# Altium project Konfident.PrjPcb
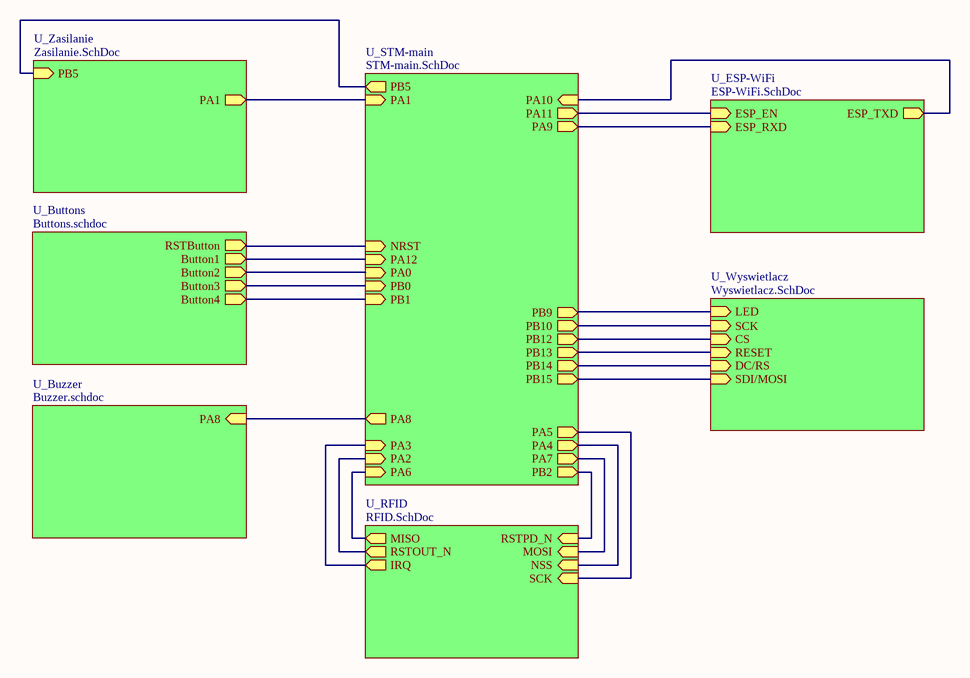
[diagram p0: Schemat_blokowy.SchDoc]
projGroupName: Niedzielni; projLocalName: Konfident; projSheetTotal: 8
8 sheets, 137 parts. Net scope: hierarchical (ports join the sheet entries above them; power ports are global).
Board file: PCB3.PcbDoc
Sheets:
  Schemat_blokowy.SchDoc
    U_Buttons = Buttons.schdoc
    U_Buzzer = Buzzer.schdoc
    U_ESP-WiFi = ESP-WiFi.SchDoc
    U_RFID = RFID.SchDoc
    U_Wyswietlacz = Wyswietlacz.SchDoc
    U_STM-main = STM-main.SchDoc
    U_Zasilanie = Zasilanie.SchDoc

## Sheet Schemat_blokowy.SchDoc
size 292 x 193 mm; Opracowal: Martyna Stankiewicz; projRevision: KD; Author: Martyna Stankiewicz; CompanyName: Politechnika Warszawska; Organization: EITI; Address1: Nowowiejska 15/19; Address2: 00-665 Warszawa; Revision: KD; SheetNumber: 1; SheetTotal: 8; HTTPLink: www.pw.edu.pl; Group_Name: Niedzielni; ProjName: Konfident

### Sub-sheets
U_Buttons = Buttons.schdoc: RSTButton (out), Button1 (out), Button2 (out), Button3 (out), Button4 (out)
U_Buzzer = Buzzer.schdoc: PA8 (in)
U_ESP-WiFi = ESP-WiFi.SchDoc: ESP_EN (in), ESP_TXD (out), ESP_RXD (in)
U_RFID = RFID.SchDoc: RSTPD_N (in), SCK (in), MISO (out), MOSI (in), NSS (in), RSTOUT_N (out), IRQ (out)
U_STM-main = STM-main.SchDoc: PA8 (out), PA9 (out), PA10 (in), PA11 (out), PA12 (in), PB9 (out), PB10 (out), PB12 (out), PB13 (out), PB14 (out), PB15 (out), NRST (in), PA0 (in), PA1 (in), PA2 (in), PA3 (in), PA5 (out), PA4 (out), PA6 (in), PA7 (out), PB0 (in), PB1 (in), PB2 (out), PB5 (out)
U_Wyswietlacz = Wyswietlacz.SchDoc: CS (in), RESET (in), DC/RS (in), SDI/MOSI (in), SCK (in), LED (in)
U_Zasilanie = Zasilanie.SchDoc: PA1 (out), PB5 (in)

### Nets
EN: sheet U_ESP-WiFi/ESP_EN, sheet U_STM-main/PA11
NRST: sheet U_Buttons/RSTButton, sheet U_STM-main/NRST
NetD2_1: sheet U_ESP-WiFi/ESP_RXD, sheet U_STM-main/PA9
NetJ2_3: sheet U_ESP-WiFi/ESP_TXD, sheet U_STM-main/PA10
NetJ4_3: sheet U_Wyswietlacz/CS, sheet U_STM-main/PB12
NetJ4_4: sheet U_Wyswietlacz/RESET, sheet U_STM-main/PB13
NetJ4_5: sheet U_Wyswietlacz/DC/RS, sheet U_STM-main/PB14
NetJ4_6: sheet U_Wyswietlacz/SDI/MOSI, sheet U_STM-main/PB15
NetJ4_7: sheet U_Wyswietlacz/SCK, sheet U_STM-main/PB10
NetJ4_8: sheet U_Wyswietlacz/LED, sheet U_STM-main/PB9
NetR6_1: sheet U_STM-main/PA1, sheet U_Zasilanie/PA1
NetR7_1: sheet U_STM-main/PB5, sheet U_Zasilanie/PB5
NetR21_1: sheet U_RFID/RSTPD_N, sheet U_STM-main/PB2
NetR23_2: sheet U_RFID/MISO, sheet U_STM-main/PA6
NetR24_2: sheet U_RFID/MOSI, sheet U_STM-main/PA7
NetR34_1: sheet U_Buzzer/PA8, sheet U_STM-main/PA8
NetS2_1: sheet U_Buttons/Button1, sheet U_STM-main/PA12
NetS3_1: sheet U_Buttons/Button2, sheet U_STM-main/PA0
NetS4_1: sheet U_Buttons/Button3, sheet U_STM-main/PB0
NetS5_1: sheet U_Buttons/Button4, sheet U_STM-main/PB1
NetU1_12: sheet U_RFID/RSTOUT_N, sheet U_STM-main/PA2
NetU1_13: sheet U_RFID/IRQ, sheet U_STM-main/PA3
NetU1_14: sheet U_RFID/NSS, sheet U_STM-main/PA4
NetU1_15: sheet U_RFID/SCK, sheet U_STM-main/PA5

### Notes on the sheet
- Data:
- Tytuł:
- Rev.:
- Rozm.:
- A4
- Strona:
- z
- PBL4
- Opracował:

## Sheet Buttons.schdoc
size 292 x 193 mm; Opracowal: Martyna Stankiewicz; projRevision: KD; Author: Martyna Stankiewicz; CompanyName: Politechnika Warszawska; Organization: EITI; Address1: Nowowiejska 15/19; Address2: 00-665 Warszawa; Revision: KD; SheetNumber: 6; SheetTotal: 8; HTTPLink: www.pw.edu.pl; Group_Name: Niedzielni; ProjName: Konfident
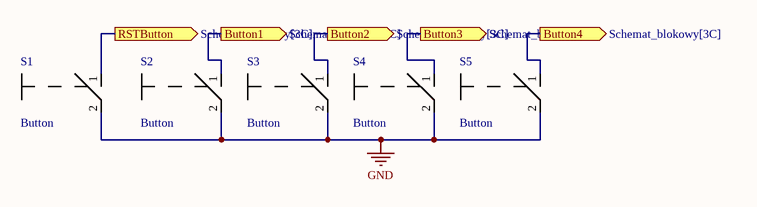
[diagram p1: Buttons.schdoc]

### Parts
S1  Button  [SW_TL59NF160Q]
S2  Button  [SW_TL59NF160Q]
S3  Button  [SW_TL59NF160Q]
S4  Button  [SW_TL59NF160Q]
S5  Button  [SW_TL59NF160Q]

### Ports
Button1 (out, see Schemat_blokowy[3C]), Button2 (out, see Schemat_blokowy[3C]), Button3 (out, see Schemat_blokowy[3C]), Button4 (out, see Schemat_blokowy[3C]), RSTButton (out, see Schemat_blokowy[3C])

### Nets
GND: S1.2 S2.2 S3.2 S4.2 S5.2
NRST: S1.1 ; port RSTButton
NetS2_1: S2.1 ; port Button1
NetS3_1: S3.1 ; port Button2
NetS4_1: S4.1 ; port Button3
NetS5_1: S5.1 ; port Button4

### Notes on the sheet
- Data:
- Tytuł:
- Rev.:
- Rozm.:
- A4
- Strona:
- z
- PBL4
- Opracował:

### Library data of the parts
S1-S5 = Button: PartNumber: TL59NF160Q

## Sheet Buzzer.schdoc
size 292 x 193 mm; Opracowal: Martyna Stankiewicz; projRevision: MM; Author: Martyna Stankiewicz; CompanyName: Politechnika Warszawska; Organization: EITI; Address1: Nowowiejska 15/19; Address2: 00-665 Warszawa; Revision: MM; SheetNumber: 7; SheetTotal: 8; HTTPLink: www.pw.edu.pl; Group_Name: Niedzielni; ProjName: Konfident
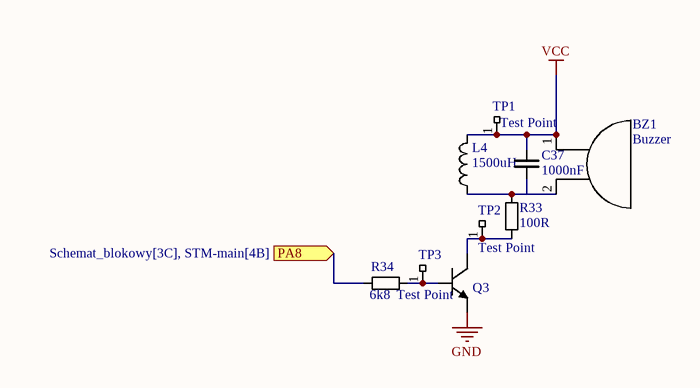
[diagram p2: Buzzer.schdoc]

### Parts
BZ1  Buzzer  [XDCR_PS1240P02BT]
C37  1000nF  [0603_CAP]
L4  1500uH  [IND_LQH43MN152K03L]
Q3  NPN  [SOT95P240X110-3N]  (value not drawn)
R33  100R  [0603_RES]
R34  6k8  [0603_RES]
TP1  Test Point  [pad]  (no BOM)
TP2  Test Point  [pad]  (no BOM)
TP3  Test Point  [pad]  (no BOM)

### Ports
PA8 (in, see Schemat_blokowy[3C], STM-main[4B])

### Nets
GND: Q3.2(E)
VCC: BZ1.1 C37.2 L4.2 TP1.1
NetBZ1_2: BZ1.2 C37.1 L4.1 R33.2
NetQ3_1: Q3.1(B) R34.2 TP3.1
NetQ3_3: Q3.3(C) R33.1 TP2.1
NetR34_1: R34.1 ; port PA8

### Notes on the sheet
- Data:
- Tytuł:
- Rev.:
- Rozm.:
- A4
- Strona:
- z
- PBL4
- Opracował:

### Library data of the parts
BZ1 = Buzzer: PartNumber: PS1240P02BT
C37 = Cap: Ceramic capacitor; Value: 1000nF
L4 = Inductor: PartNumber: LQH43MN152J03L; Value: 1500uH; Link: https://www.digikey.pl/en/products/detail/murata-electronics/LQH43MN152J03L/2594506?_gl=1*1qj429k*_up*MQ..*_gs*MQ..&gclid=Cj0KCQjwqcO_BhDaARIsACz62vPoBc739cp1REhPwRacIq9Hmi_6DHVVJt4UIt_29A6Hw2SO46MFMW8aApgZEALw_wcB&gclsrc=aw.ds
Q3 = NPN: NPN General-purpose Transistor; PartNumber: BC848C-7-F; Link: https://www.digikey.pl/en/products/detail/diodes-incorporated/BC848C-7-F/1934460?s=N4IgTCBcDaIEIGEAcAWJCC0B2DAxEAugL5A
R33 R34 = RES: Resistor
  R33: Value: 100R
  R34: Value: 6k8

## Sheet ESP-WiFi.SchDoc
size 292 x 193 mm; Opracowal: Krzysztof Dobosz; projRevision: MS; CompanyName: Politechnika Warszawska; Organization: EITI; Address1: Nowowiejska 15/19; Address2: 00-665 Warszawa; Revision: MS; SheetNumber: 3; SheetTotal: 8; HTTPLink: www.pw.edu.pl; Group_Name: Niedzielni; ProjName: Konfident
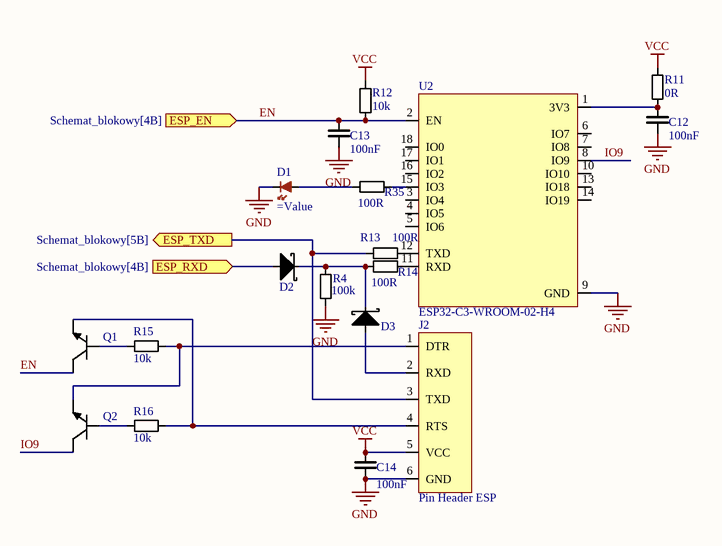
[diagram p3: ESP-WiFi.SchDoc]

### Parts
C12  100nF  [0603_CAP]
C13  100nF  [0603_CAP]
C14  100nF  [0603_CAP]
D1  (no value)  [0603_LED_R_Reflow]
D2  (no value)  [SOT23-R]
D3  (no value)  [SOT23-R]
J2  Pin Header ESP  [SAMTEC_TSW-112-16-T-S-06]
Q1  NPN  [SOT95P240X110-3N]  (value not drawn)
Q2  NPN  [SOT95P240X110-3N]  (value not drawn)
R4  100k  [0603_RES]
R11  0R  [0603_RES]
R12  10k  [0603_RES]
R13  100R  [0603_RES]
R14  100R  [0603_RES]
R15  10k  [0603_RES]
R16  10k  [0603_RES]
R35  100R  [0603_RES]
U2  ESP32-C3-WROOM-02-H4  [MODULE_ESP32-C3-WROOM-02-H4]

### Ports
ESP_EN (in, see Schemat_blokowy[4B]), ESP_RXD (in, see Schemat_blokowy[4B]), ESP_TXD (out, see Schemat_blokowy[5B])

### Nets
GND: C12.1 C13.1 C14.1 D1.2(K) J2.6(GND) R4.1 U2.9(GND)
VCC: C14.2 J2.5(VCC) R11.2 R12.2
EN: C13.2 Q1.3(C) R12.1 U2.2(EN) ; port ESP_EN
IO9: Q2.3(C) U2.8(IO9)
NetC12_2: C12.2 R11.1 U2.1(3V3)
NetD1_1: D1.1(A) R35.1
NetD2_1: D2.1(A) ; port ESP_RXD
NetD2_3: D2.3(K) D3.3(K) R4.2 R14.1
NetD3_1: D3.1(A) J2.2(RXD)
NetJ2_1: J2.1(DTR) Q2.2(E) R15.1
NetJ2_3: J2.3(TXD) R13.1 ; port ESP_TXD
NetJ2_4: J2.4(RTS) Q1.2(E) R16.1
NetQ1_1: Q1.1(B) R15.2
NetQ2_1: Q2.1(B) R16.2
NetR13_2: R13.2 U2.12(TXD)
NetR14_2: R14.2 U2.11(RXD)
NetR35_2: R35.2 U2.15(IO3)

Not connected (* = marked no-connect by the designer): U2 3(IO4) 4(IO5) 5(IO6) 6(IO7) 7(IO8) 10(IO10) 13(IO18) 14(IO19) 16(IO2) 17(IO1) 18(IO0)

### Notes on the sheet
- Data:
- Tytuł:
- Rev.:
- Rozm.:
- A4
- Strona:
- z
- PBL4
- Opracował:

### Library data of the parts
C12-C14 = Cap: Ceramic capacitor; Value: 100nF
D1 = LED_R_small: Red LED diode; PartNumber: APT1608SURC; Link: https://www.mouser.pl/ProductDetail/Kingbright/APT1608SURC?qs=SxaZfIVsCL1abw2IbECoZw%3D%3D
D2 D3 = D Schottky: Schottky Diode; PartNumber: BAT54C; Link: https://www.digikey.pl/en/products/detail/diotec-semiconductor/BAT54C/13163831
Q1 Q2 = NPN: as Q3 on sheet Buzzer; Link: https://www.digikey.pl/en/products/detail/diodes-incorporated/BC848C-7-F/1934460?s=N4IgTCBcDaIEIGEAcAWJCC0B2DAxEAugL5A
R4 R11-R16 R35 = RES: Resistor
  R4: Value: 100k
  R11: Value: 0R
  R12 R15 R16: Value: 10k
  R13 R14 R35: Value: 100R
U2 = ESP32-C3-WROOM-02-H4: WiFi Modules (802.11) (Engineering Samples) SMD module, ESP32-C3, 4MB SPI flash, PCB antenna, -40 C +105 C; MF: Espressif Systems; MP: ESP32-C3-WROOM-02-H4; Package: Package; Purchase-URL: https://pricing.snapeda.com/search/part/ESP32-C3-WROOM-02-H4/?ref=eda; Check_prices: https://www.snapeda.com/parts/ESP32-C3-WROOM-02-H4/Espressif+Systems/view-part/?ref=eda; SnapEDA_Link: https://www.snapeda.com/parts/ESP32-C3-WROOM-02-H4/Espressif+Systems/view-part/?ref=snap; Price: None; Availability: In Stock; Value: *; PartNumber: ESP32-C3-WROOM-02-H4

## Sheet RFID.SchDoc
size 292 x 193 mm; Opracowal: Krzysztof Dobosz; projRevision: MM; Author: Krzysztof Dobosz; CompanyName: Politechnika Warszawska; Organization: EITI; Address1: Nowowiejska 15/19; Address2: 00-665 Warszawa; Revision: MM; SheetNumber: 4; SheetTotal: 8; HTTPLink: www.pw.edu.pl; Group_Name: Niedzielni; ProjName: Konfident
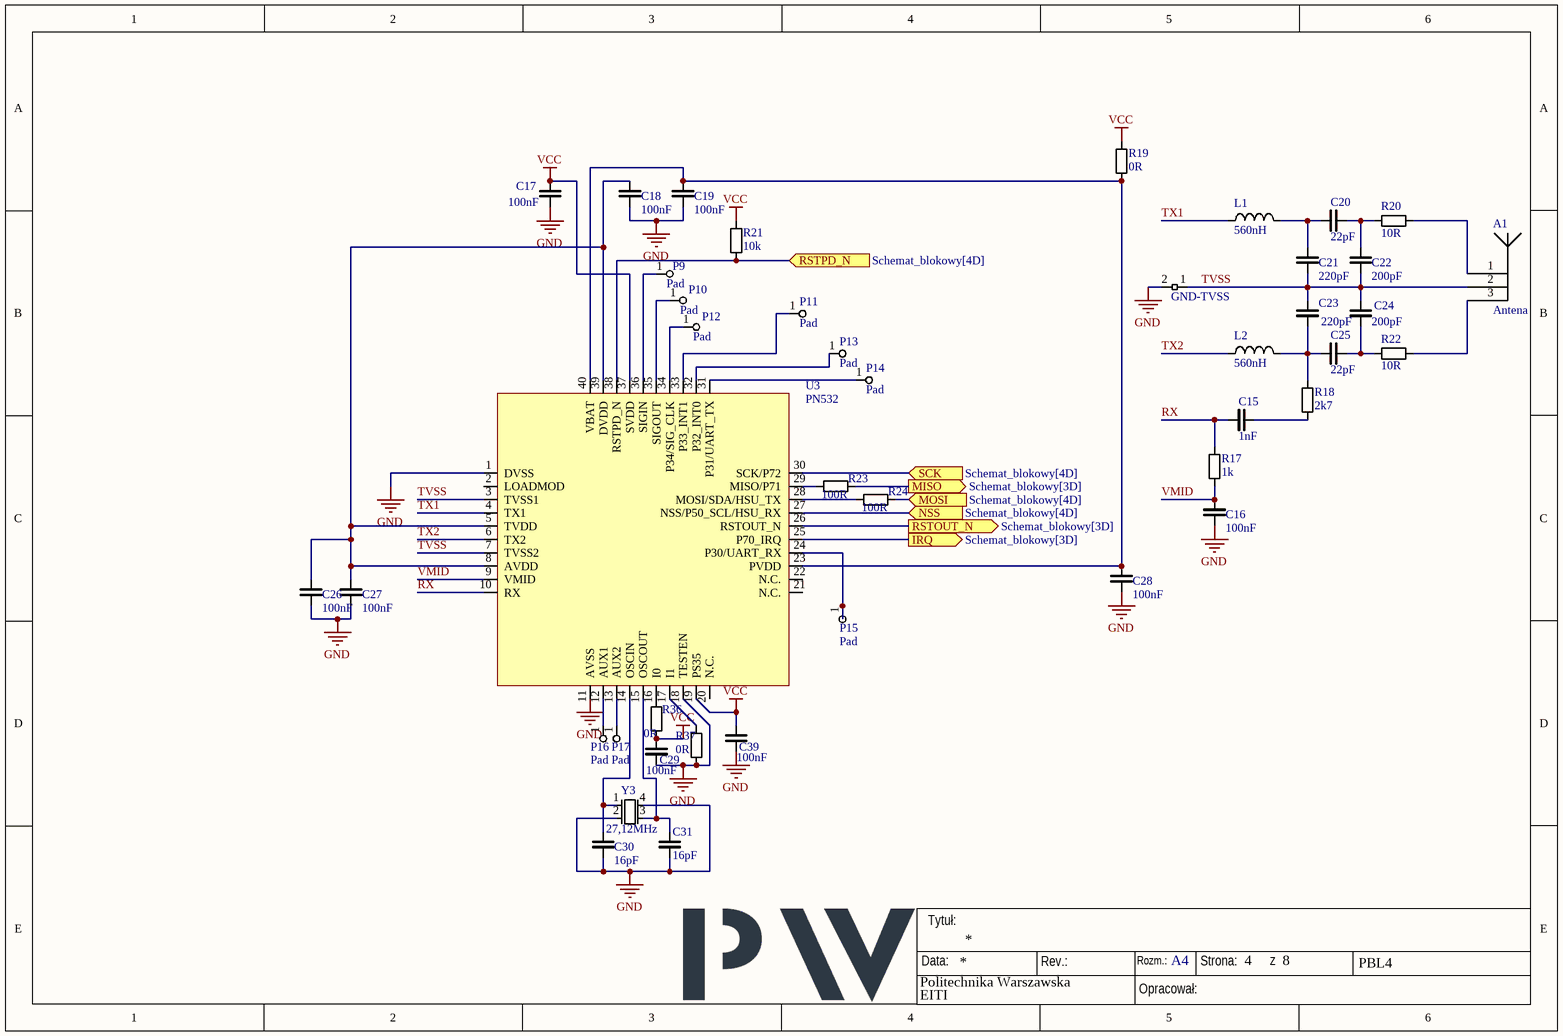
[diagram p4: RFID.SchDoc]

### Parts
A1  Antena  [Antena_RFID]  (net tie, no BOM)
C15  1nF  [0603_CAP]
C16  100nF  [0603_CAP]
C17  100nF  [0603_CAP]
C18  100nF  [0603_CAP]
C19  100nF  [0603_CAP]
C20  22pF  [0603_CAP]
C21  220pF  [0603_CAP]
C22  200pF  [0603_CAP]
C23  220pF  [0603_CAP]
C24  200pF  [0603_CAP]
C25  22pF  [0603_CAP]
C26  100nF  [0603_CAP]
C27  100nF  [0603_CAP]
C28  100nF  [0603_CAP]
C29  100nF  [0603_CAP]
C30  16pF  [0603_CAP]
C31  16pF  [0603_CAP]
C39  100nF  [0603_CAP]
L1  560nH  [0603_IND]
L2  560nH  [0603_IND]
P9  Pad  [pad]  (no BOM)
P10  Pad  [pad]  (no BOM)
P11  Pad  [pad]  (no BOM)
P12  Pad  [pad]  (no BOM)
P13  Pad  [pad]  (no BOM)
P14  Pad  [pad]  (no BOM)
P15  Pad  [pad]  (no BOM)
P16  Pad  [pad]  (no BOM)
P17  Pad  [pad]  (no BOM)
R17  1k  [0603_RES]
R18  2k7  [0603_RES]
R19  0R  [0603_RES]
R20  10R  [0603_RES]
R21  10k  [0603_RES]
R22  10R  [0603_RES]
R23  100R  [0603_RES]
R24  100R  [0603_RES]
R36  0R  [0603_RES]
R37  0R  [0603_RES]
U3  PN532  [QFN40G-0.5-6X6MM]
Y3  27,12MHz  [XTAL_ABM8-27.120MHZ-10-D1G-T]
  GND-TVSS  [GND-TVSS]  (net tie, no BOM)

### Ports
IRQ (out, see Schemat_blokowy[3D]), MISO (out, see Schemat_blokowy[3D]), MOSI (in, see Schemat_blokowy[4D]), NSS (in, see Schemat_blokowy[4D]), RSTOUT_N (out, see Schemat_blokowy[3D]), RSTPD_N (in, see Schemat_blokowy[4D]), SCK (in, see Schemat_blokowy[4D])

### Nets
GND: C16.1 C17.1 C18.1 C19.1 C26.1 C27.1 C28.1 C29.1 C30.1 C31.1 C39.1 R37.1 U3.1(DVSS) U3.11(AVSS) U3.18(TESTEN) Y3.2 Y3.4 .2
VCC: C17.2 C29.2 C39.2 R19.2 R21.2 R36.1 U3.19(PS35) U3.37(SVDD)
RX: C15.1 R17.2 U3.10(RX)
TVSS: A1.2 C21.1 C22.1 C23.2 C24.2 U3.3(TVSS1) U3.7(TVSS2) .1
TX1: L1.1 U3.4(TX1)
TX2: L2.1 U3.6(TX2)
VMID: C16.2 R17.1 U3.9(VMID)
NetA1_1: A1.1 R20.1
NetA1_3: A1.3 R22.1
NetC15_2: C15.2 R18.1
NetC18_2: C18.2 C26.2 C27.2 U3.5(TVDD) U3.8(AVDD) U3.39(DVDD)
NetC19_2: C19.2 C28.2 R19.1 U3.23(PVDD) U3.40(VBAT)
NetC20_1: C20.1 C22.2 R20.2
NetC20_2: C20.2 C21.2 L1.2
NetC23_1: C23.1 C25.2 L2.2 R18.2
NetC24_1: C24.1 C25.1 R22.2
NetC30_2: C30.2 U3.14(OSCIN) Y3.1
NetC31_2: C31.2 U3.15(OSCOUT) Y3.3
NetP9_1: P9.1 U3.36(SIGIN)
NetP10_1: P10.1 U3.35(SIGOUT)
NetP11_1: P11.1 U3.33(P33_INT1)
NetP12_1: P12.1 U3.34(P34/SIG_CLK)
NetP13_1: P13.1 U3.32(P32_INT0)
NetP14_1: P14.1 U3.31(P31/UART_TX)
NetP15_1: P15.1 U3.24(P30/UART_RX)
NetP16_1: P16.1 U3.12(AUX1)
NetP17_1: P17.1 U3.13(AUX2)
NetR21_1: R21.1 U3.38(RSTPD_N) ; port RSTPD_N
NetR23_1: R23.1 U3.29(MISO/P71)
NetR23_2: R23.2 ; port MISO
NetR24_1: R24.1 U3.28(MOSI/SDA/HSU_TX)
NetR24_2: R24.2 ; port MOSI
NetR36_2: R36.2 U3.16(I0)
NetR37_2: R37.2 U3.17(I1)
NetU1_12: U3.26(RSTOUT_N) ; port RSTOUT_N
NetU1_13: U3.25(P70_IRQ) ; port IRQ
NetU1_14: U3.27(NSS/P50_SCL/HSU_RX) ; port NSS
NetU1_15: U3.30(SCK/P72) ; port SCK

Not connected (* = marked no-connect by the designer): U3 2(LOADMOD) 20(N.C.) 21(N.C.) 22(N.C.)

### Notes on the sheet
- Data:
- Tytuł:
- Rev.:
- Rozm.:
- A4
- Strona:
- z
- PBL4
- Opracował:

### Library data of the parts
C15-C31 C39 = Cap: Ceramic capacitor
  C15: Value: 1nF
  C16-C19 C26-C29 C39: Value: 100nF
  C20 C25: Value: 22pF
  C21 C23: Value: 220pF
  C22 C24: Value: 200pF
  C30 C31: Value: 16pF
L1 L2 = Inductor: PartNumber: CS160808-R56K; Value: 560nH; Link: https://www.digikey.pl/en/products/detail/bourns-inc/CS160808-R56K/3782656?_gl=1*10p3aaq*_up*MQ..*_gs*MQ..&gclid=Cj0KCQjwqcO_BhDaARIsACz62vPoBc739cp1REhPwRacIq9Hmi_6DHVVJt4UIt_29A6Hw2SO46MFMW8aApgZEALw_wcB&gclsrc=aw.ds
R17-R24 R36 R37 = RES: Resistor
  R17: Value: 1k
  R18: Value: 2k7
  R19 R36 R37: Value: 0R
  R20 R22: Value: 10R
  R21: Value: 10k
  R23 R24: Value: 100R
U3 = PN532: RFID module; PartNumber: PN5321A3HN/C106,55; Link: https://www.digikey.pl/en/products/detail/nxp-usa-inc/PN5321A3HN-C106-55/2296487
Y3 = Oscylator4: Oscilator; PartNumber: ABM8-27.120MHZ-10-D1G-T; Value: 27,12MHz; Link: https://www.digikey.pl/en/products/detail/abracon-llc/ABM8-27-120MHZ-10-D1G-T/8582027?_gl=1%2A1j4zvvg%2A_up%2AMQ..%2A_gs%2AMQ..&gclid=Cj0KCQjwtJ6_BhDWARIsAGanmKdDq7PmRTSwRQOEO6Y2chDsJ8ztLHAI7vvkfzRwrFQTKCYtsUalh8YaArHxEALw_wcB&gclsrc=aw.ds&fbclid=IwZXh0bgNhZW0CMTEAAR7Ivqi7CRUEsP8rOnd4--mHHE_K_pobXq-Us6J-BY0xbOx55-b20eDGrpVyWg_aem_WjV6ZaoX7HlUqguWX5el7Q

## Sheet Wyswietlacz.SchDoc
size 292 x 193 mm; Opracowal: Mieszko Mazurkiewicz; projRevision: MS; Author: Mieszko Mazurkiewicz; CompanyName: Politechnika Warszawska; Organization: EITI; Address1: Nowowiejska 15/19; Address2: 00-665 Warszawa; Revision: MS; SheetNumber: 8; SheetTotal: 8; HTTPLink: www.pw.edu.pl; Group_Name: Niedzielni; ProjName: Konfident
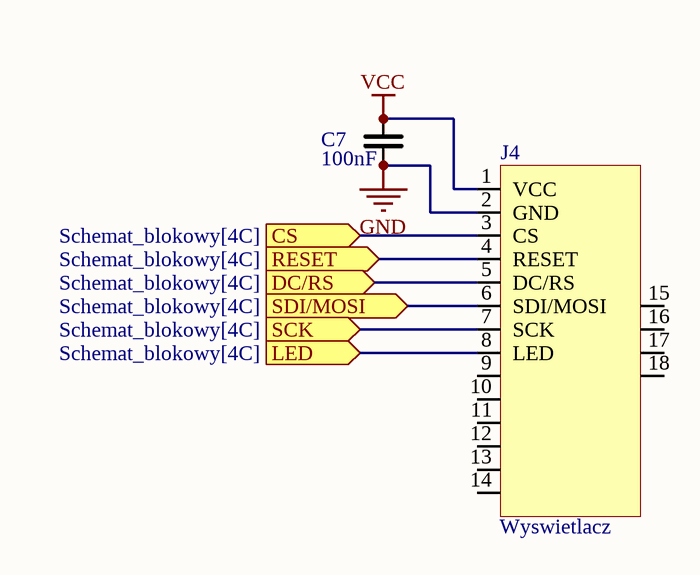
[diagram p5: Wyswietlacz.SchDoc]

### Parts
C7  100nF  [0603_CAP]
J4  Wyswietlacz  [pin_header_LCD]

### Ports
CS (in, see Schemat_blokowy[4C]), DC/RS (in, see Schemat_blokowy[4C]), LED (in, see Schemat_blokowy[4C]), RESET (in, see Schemat_blokowy[4C]), SCK (in, see Schemat_blokowy[4C]), SDI/MOSI (in, see Schemat_blokowy[4C])

### Nets
GND: C7.1 J4.2(GND)
VCC: C7.2 J4.1(VCC)
NetJ4_3: J4.3(CS) ; port CS
NetJ4_4: J4.4(RESET) ; port RESET
NetJ4_5: J4.5(DC/RS) ; port DC/RS
NetJ4_6: J4.6(SDI/MOSI) ; port SDI/MOSI
NetJ4_7: J4.7(SCK) ; port SCK
NetJ4_8: J4.8(LED) ; port LED

Not connected (* = marked no-connect by the designer): J4 9 10 11 12 13 14 15 16 17 18

### Notes on the sheet
- Data:
- Tytuł:
- Rev.:
- Rozm.:
- A4
- Strona:
- z
- PBL4
- Opracował:

### Library data of the parts
C7 = Cap: Ceramic capacitor; Value: 100nF
J4 = Pin Header Wyswietlacz: Dispaly; PartNumber: ILI9486

## Sheet STM-main.SchDoc
size 292 x 193 mm; Opracowal: Mieszko Mazurkiewicz; projRevision: KD; Author: Mieszko Mazurkiewicz; CompanyName: Politechnika Warszawska; Organization: EITI; Address1: Nowowiejska 15/19; Address2: 00-665 Warszawa; Revision: KD; SheetNumber: 2; SheetTotal: 8; HTTPLink: www.pw.edu.pl; Group_Name: Niedzielni; ProjName: Konfident
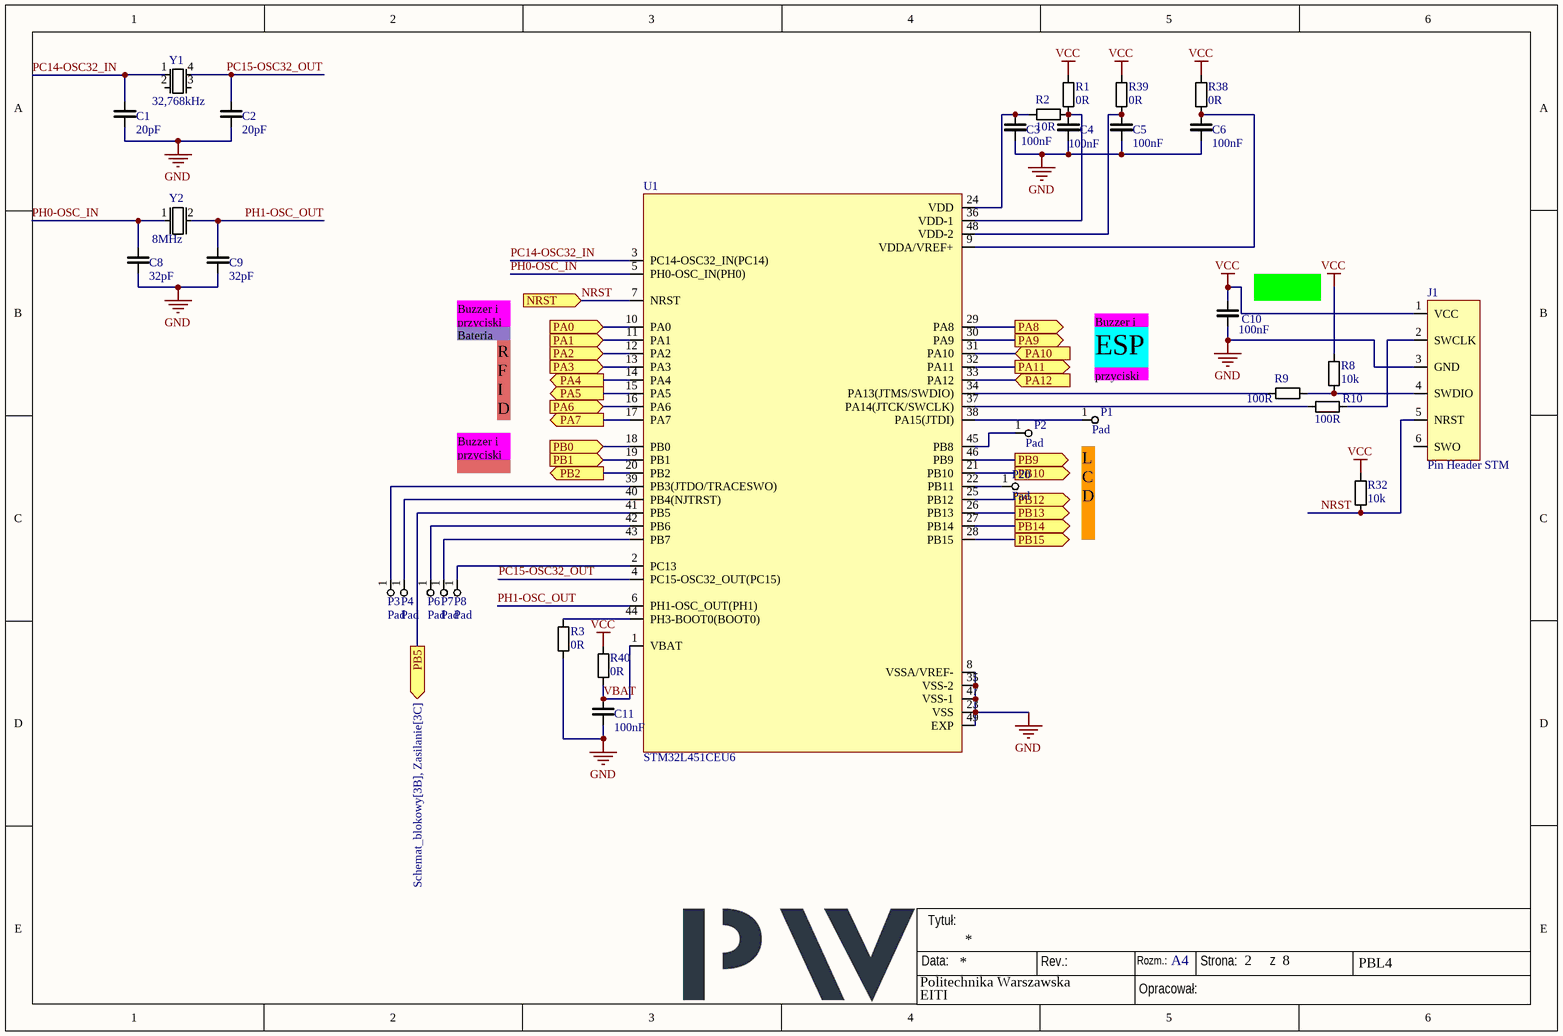
[diagram p6: STM-main.SchDoc]

### Parts
C1  20pF  [0603_CAP]
C2  20pF  [0603_CAP]
C3  100nF  [0603_CAP]
C4  100nF  [0603_CAP]
C5  100nF  [0603_CAP]
C6  100nF  [0603_CAP]
C8  32pF  [0603_CAP]
C9  32pF  [0603_CAP]
C10  100nF  [0603_CAP]
C11  100nF  [0603_CAP]
J1  Pin Header STM  [SAMTEC_TSW-112-16-T-S-06]
P1  Pad  [pad]  (no BOM)
P2  Pad  [pad]  (no BOM)
P3  Pad  [pad]  (no BOM)
P4  Pad  [pad]  (no BOM)
P6  Pad  [pad]  (no BOM)
P7  Pad  [pad]  (no BOM)
P8  Pad  [pad]  (no BOM)
P20  Pad  [pad]  (no BOM)
R1  0R  [0603_RES]
R2  10R  [0603_RES]
R3  0R  [0603_RES]
R8  10k  [0603_RES]
R9  100R  [0603_RES]
R10  100R  [0603_RES]
R32  10k  [0603_RES]
R38  0R  [0603_RES]
R39  0R  [0603_RES]
R40  0R  [0603_RES]
U1  STM32L451CEU6  [QFN50P700X700X60-49N]
Y1  32,768kHz  [Q 0,032768-SMQ32SL-12,5-20-T1-LF]
Y2  8MHz  [ATS080BSM-1E]

### Ports
NRST (in, see Schemat_blokowy[3C]), PA0 (in, see Schemat_blokowy[3C]), PA1 (in, see Schemat_blokowy[3B], Zasilanie[3B]), PA2 (in, see Schemat_blokowy[3D]), PA3 (in, see Schemat_blokowy[3D]), PA4 (out, see Schemat_blokowy[4D]), PA5 (out, see Schemat_blokowy[4D]), PA6 (in, see Schemat_blokowy[3D]), PA7 (out, see Schemat_blokowy[4D]), PA8 (out, see Schemat_blokowy[3C], Buzzer[2C]), PA9 (out, see Schemat_blokowy[4B]), PA10 (in, see Schemat_blokowy[4B]), PA11 (out, see Schemat_blokowy[4B]), PA12 (in, see Schemat_blokowy[3C]), PB0 (in, see Schemat_blokowy[3C]), PB1 (in, see Schemat_blokowy[3C]), PB2 (out, see Schemat_blokowy[4D]), PB5 (out, see Schemat_blokowy[3B], Zasilanie[3C]), PB9 (out, see Schemat_blokowy[4C]), PB10 (out, see Schemat_blokowy[4C]), PB12 (out, see Schemat_blokowy[4C]), PB13 (out, see Schemat_blokowy[4C]), PB14 (out, see Schemat_blokowy[4C]), PB15 (out, see Schemat_blokowy[4C])

### Nets
GND: C1.1 C2.1 C3.1 C4.1 C5.1 C6.1 C8.1 C9.1 C10.1 C11.1 J1.3(GND) R3.1 U1.8(VSSA/VREF-) U1.23(VSS) U1.35(VSS-2) U1.47(VSS-1) U1.49(EXP)
VCC: C10.2 J1.1(VCC) R1.2 R8.2 R32.2 R38.2 R39.2 R40.2
EN: U1.32(PA11) ; port PA11
NRST: J1.5(NRST) R32.1 U1.7(NRST) ; port NRST
PC14-OSC32_IN: C1.2 U1.3(PC14-OSC32_IN(PC14)) Y1.1
PC15-OSC32_OUT: C2.2 U1.4(PC15-OSC32_OUT(PC15)) Y1.4
PH0-OSC_IN: C8.2 U1.5(PH0-OSC_IN(PH0)) Y2.1
PH1-OSC_OUT: C9.2 U1.6(PH1-OSC_OUT(PH1)) Y2.2
VBAT: C11.2 R40.1 U1.1(VBAT)
NetC3_2: C3.2 R2.1 U1.24(VDD)
NetC4_2: C4.2 R1.1 R2.2 U1.36(VDD-1)
NetC5_2: C5.2 R39.1 U1.48(VDD-2)
NetC6_2: C6.2 R38.1 U1.9(VDDA/VREF+)
NetD2_1: U1.30(PA9) ; port PA9
NetJ1_2: J1.2(SWCLK) R10.2
NetJ1_4: J1.4(SWDIO) R8.1 R9.2
NetJ2_3: U1.31(PA10) ; port PA10
NetJ4_3: U1.25(PB12) ; port PB12
NetJ4_4: U1.26(PB13) ; port PB13
NetJ4_5: U1.27(PB14) ; port PB14
NetJ4_6: U1.28(PB15) ; port PB15
NetJ4_7: U1.21(PB10) ; port PB10
NetJ4_8: U1.46(PB9) ; port PB9
NetP1_1: P1.1 U1.38(PA15(JTDI))
NetP2_1: P2.1 U1.45(PB8)
NetP3_1: P3.1 U1.39(PB3(JTDO/TRACESWO))
NetP4_1: P4.1 U1.40(PB4(NJTRST))
NetP6_1: P6.1 U1.42(PB6)
NetP7_1: P7.1 U1.43(PB7)
NetP8_1: P8.1 U1.2(PC13)
NetP20_1: P20.1 U1.22(PB11)
NetR3_2: R3.2 U1.44(PH3-BOOT0(BOOT0))
NetR6_1: U1.11(PA1) ; port PA1
NetR7_1: U1.41(PB5) ; port PB5
NetR9_1: R9.1 U1.34(PA13(JTMS/SWDIO))
NetR10_1: R10.1 U1.37(PA14(JTCK/SWCLK))
NetR21_1: U1.20(PB2) ; port PB2
NetR23_2: U1.16(PA6) ; port PA6
NetR24_2: U1.17(PA7) ; port PA7
NetR34_1: U1.29(PA8) ; port PA8
NetS2_1: U1.33(PA12) ; port PA12
NetS3_1: U1.10(PA0) ; port PA0
NetS4_1: U1.18(PB0) ; port PB0
NetS5_1: U1.19(PB1) ; port PB1
NetU1_12: U1.12(PA2) ; port PA2
NetU1_13: U1.13(PA3) ; port PA3
NetU1_14: U1.14(PA4) ; port PA4
NetU1_15: U1.15(PA5) ; port PA5

Not connected (* = marked no-connect by the designer): J1 6(SWO); Y1 2 3

### Notes on the sheet
- (near C10) SWD
- Buzzer i
  przyciski
- Bateria
- (near P1) Buzzer i
  przyciski
- ESP
- R
  F
  I
  D
- RFID
- (near P1) L
  C
  D
- Data:
- Tytuł:
- Rev.:
- Rozm.:
- A4
- Strona:
- z
- PBL4
- Opracował:

### Library data of the parts
C1-C6 C8-C11 = Cap: Ceramic capacitor
  C1 C2: Value: 20pF
  C3-C6 C10 C11: Value: 100nF
  C8 C9: Value: 32pF
R1-R3 R8-R10 R32 R38-R40 = RES: Resistor
  R1 R3 R38-R40: Value: 0R
  R2: Value: 10R
  R8 R32: Value: 10k
  R9 R10: Value: 100R
Y1 = Oscylator4: Oscilator; Value: 32,768kHz; PartNumber: Q 0,032768-SMQ32SL-12,5-20-T1-LF; Link: https://www.digikey.pl/en/products/detail/jauch-quartz/Q-0-032768-SMQ32SL-12-5-20-T1-LF/21286751?_gl=1%2A2eagbn%2A_up%2AMQ..%2A_gs%2AMQ..&gclid=Cj0KCQjwtJ6_BhDWARIsAGanmKdDq7PmRTSwRQOEO6Y2chDsJ8ztLHAI7vvkfzRwrFQTKCYtsUalh8YaArHxEALw_wcB&gclsrc=aw.ds&fbclid=IwZXh0bgNhZW0CMTEAAR5vhhD_Q673JviUlLJ614BYKrSfCtvcQBHdiJxk0akfVJH2lUWrq4RgPhm8Mw_aem_d1V_8h-L4hTcNT0FPwb2dg
Y2 = Oscylator: Oscilator; Value: 8MHz; PartNumber: ATS080BSM-1E; Link: https://www.digikey.pl/en/products/detail/cts-frequency-controls/ATS080BSM-1E/4308686?_gl=1%2Acv1dpn%2A_up%2AMQ..%2A_gs%2AMQ..&gclid=Cj0KCQjwtJ6_BhDWARIsAGanmKdDq7PmRTSwRQOEO6Y2chDsJ8ztLHAI7vvkfzRwrFQTKCYtsUalh8YaArHxEALw_wcB&gclsrc=aw.ds&fbclid=IwZXh0bgNhZW0CMTEAAR769WtCyuMDpBpLjQbkyGDyyz4UOol-R9__mkEURnvs7i-NTlbvwc0iaZLtNw_aem_AJwTIGPzL7xMi4E202jF3w
U1 = STM32L451CEU6: PartNumber: STM32L451CEU6

## Sheet Zasilanie.SchDoc
size 292 x 193 mm; SPICEModelCacheTYRFPEPP: <root> / <DocumentId>TYRFPEPP</DocumentId> / </root>; Opracowal: Krzysztof Dobosz; projRevision: MM; Author: Krzysztof Dobosz; CompanyName: Politechnika Warszawska; Organization: EITI; Address1: Nowowiejska 15/19; Address2: 00-665 Warszawa; Revision: MM; SheetNumber: 5; SheetTotal: 8; HTTPLink: www.pw.edu.pl; Group_Name: Niedzielni; ProjName: Konfident
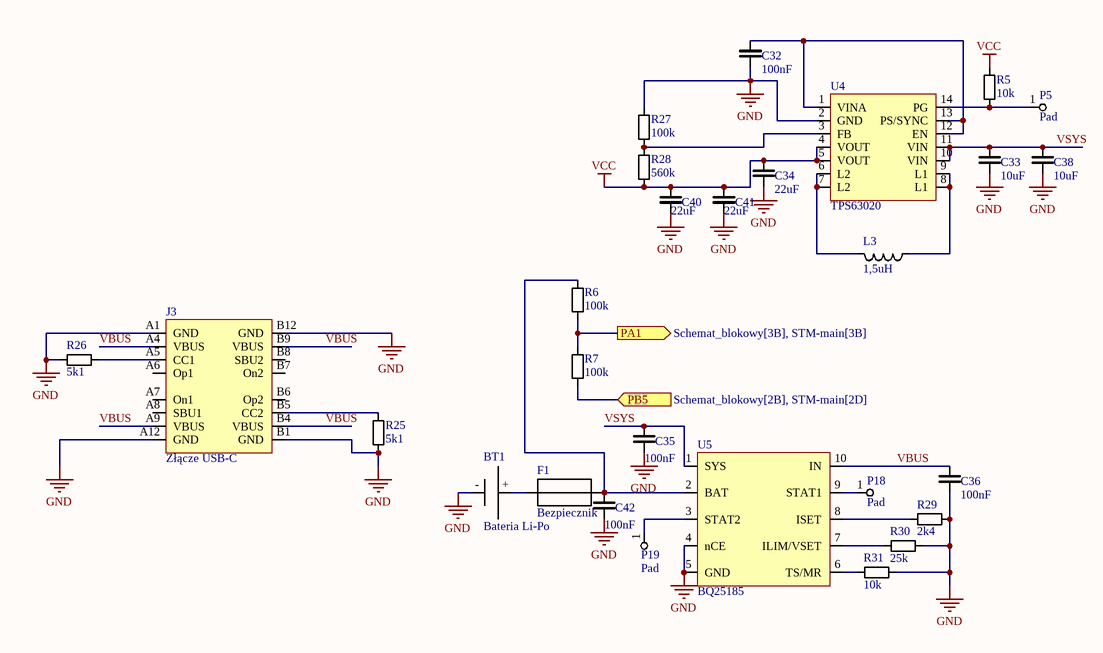
[diagram p7: Zasilanie.SchDoc]

### Parts
BT1  Bateria Li-Po  [LP623255 3,7V 1100mAh]  (net tie)
C32  100nF  [0603_CAP]
C33  10uF  [0603_CAP]
C34  22uF  [0603_CAP]
C35  100nF  [0603_CAP]
C36  100nF  [0603_CAP]
C38  10uF  [0603_CAP]
C40  22uF  [0603_CAP]
C41  22uF  [0603_CAP]
C42  100nF  [0603_CAP]
F1  Bezpiecznik  [0603_FUSE]
J3  Złącze USB-C  [HRO_TYPE-C-31-M-12]
L3  1,5uH  [0603_IND]
P5  Pad  [pad]  (no BOM)
P18  Pad  [pad]  (no BOM)
P19  Pad  [pad]  (no BOM)
R5  10k  [0603_RES]
R6  100k  [0603_RES]
R7  100k  [0603_RES]
R25  5k1  [0603_RES]
R26  5k1  [0603_RES]
R27  100k  [0603_RES]
R28  560k  [0603_RES]
R29  2k4  [0603_RES]
R30  25k  [0603_RES]
R31  10k  [0603_RES]
U4  TPS63020  [IC_TPS63020DSJT]
U5  BQ25185  [SON50P250X250X80-11N]

### Ports
PA1 (out, see Schemat_blokowy[3B], STM-main[3B]), PB5 (in, see Schemat_blokowy[2B], STM-main[2D])

### Nets
GND: BT1.- C32.1 C33.1 C34.1 C35.1 C36.1 C38.1 C40.1 C41.1 C42.1 J3.A1(GND) J3.A12(GND) J3.B1(GND) J3.B12(GND) R25.1 R26.2 R27.2 R29.2 R30.2 R31.1 U4.2(GND) U5.4(nCE) U5.5(GND)
VCC: C34.2 C40.2 C41.2 R5.2 R28.1 U4.4(VOUT) U4.5(VOUT)
VBUS: C36.2 J3.A4(VBUS) J3.A9(VBUS) J3.B4(VBUS) J3.B9(VBUS) U5.10(IN)
VSYS: C33.2 C35.2 C38.2 U4.10(VIN) U4.11(VIN) U5.1(SYS)
NetBT1_+: BT1.+ F1.1
NetC32_2: C32.2 U4.1(VINA) U4.12(EN) U4.13(PS/SYNC)
NetC42_2: C42.2 F1.2 R6.2 U5.2(BAT)
NetJ3_A5: J3.A5(CC1) R26.1
NetJ3_B5: J3.B5(CC2) R25.2
NetL3_1: L3.1 U4.8(L1) U4.9(L1)
NetL3_2: L3.2 U4.6(L2) U4.7(L2)
NetP5_1: P5.1 R5.1 U4.14(PG)
NetP18_1: P18.1 U5.9(STAT1)
NetP19_1: P19.1 U5.3(STAT2)
NetR6_1: R6.1 R7.2 ; port PA1
NetR7_1: R7.1 ; port PB5
NetR27_1: R27.1 R28.2 U4.3(FB)
NetR29_1: R29.1 U5.8(ISET)
NetR30_1: R30.1 U5.7(ILIM/VSET)
NetR31_2: R31.2 U5.6(TS/MR)

Not connected (* = marked no-connect by the designer): J3 A6(Op1) A7(On1) A8(SBU1) B6(Op2) B7(On2) B8(SBU2)

### Notes on the sheet
- Data:
- Tytuł:
- Rev.:
- Rozm.:
- A4
- Strona:
- z
- PBL4
- Opracował:

### Library data of the parts
C32-C36 C38 C40-C42 = Cap: Ceramic capacitor
  C32 C35 C36 C42: Value: 100nF
  C33 C38: Value: 10uF
  C34 C40 C41: Value: 22uF
F1 = Bezpiecznik: PartNumber: FMC16132WBTP; Link: https://www.digikey.pl/en/products/detail/kamaya-inc/FMC16132WBTP/15181255?_gl=1*1dq3pzm*_up*MQ..*_gs*MQ..&gclid=Cj0KCQjwqcO_BhDaARIsACz62vPoBc739cp1REhPwRacIq9Hmi_6DHVVJt4UIt_29A6Hw2SO46MFMW8aApgZEALw_wcB&gclsrc=aw.ds
J3 = Zlacze USB-C: PartNumber: 1332645; Link: https://www.digikey.pl/en/products/detail/phoenix-contact/1332645/17939578?fbclid=IwZXh0bgNhZW0CMTEAAR4Mdx9K9mJtLriTlYBZWbvmrlnITj3LSQ6iRN-YLuJkxgkM2rs57scEXE8Y3Q_aem_wESm8VjYaC4rfR53j8jRMw
L3 = Inductor: PartNumber: LSCNB1608HKT1R5MD; Value: 1,5uH; Link: https://www.digikey.pl/en/products/detail/taiyo-yuden/LSCNB1608HKT1R5MD/16667727?_gl=1%2A13aiihm%2A_up%2AMQ..%2A_gs%2AMQ..&gclid=Cj0KCQjwqcO_BhDaARIsACz62vPoBc739cp1REhPwRacIq9Hmi_6DHVVJt4UIt_29A6Hw2SO46MFMW8aApgZEALw_wcB&gclsrc=aw.ds&fbclid=IwZXh0bgNhZW0CMTEAAR5Hn44r6Y2tzqTa524hLU7tYgTtQnsMOIJjjoEy5tsCrLoSHtHj1OLLqk7kUg_aem_Mnh3PQQOy2cwiP9hppDfXg
R5-R7 R25-R31 = RES: Resistor
  R5 R31: Value: 10k
  R6 R7 R27: Value: 100k
  R25 R26: Value: 5k1
  R28: Value: 560k
  R29: Value: 2k4
  R30: Value: 25k
U4 = Stabilizator napięcia: Przetwornica impulsowa; PartNumber: TPS63020DSJR; Link: https://www.digikey.pl/en/products/detail/texas-instruments/TPS63020DSJR/2353761
U5 = BQ25185: Battery charger; PartNumber: BQ25185DLHR; Link: https://www.digikey.pl/en/products/detail/texas-instruments/BQ25185DLHR/21769368?s=N4IgTCBcDaIEIEUwFYCMAOZIC6BfIA
BT1 = Bateria Li-Po: PartNumber: LP623255 3,7V 1100mAh

## Nets that join several sheets
GND: Buttons (5 pins), Buzzer (Q3.2), ESP-WiFi (7 pins), RFID (18 pins), Wyswietlacz (C7.1 J4.2), STM-main (17 pins), Zasilanie (23 pins)
VCC: Buzzer (BZ1.1 C37.2 L4.2 TP1.1), ESP-WiFi (C14.2 J2.5 R11.2 R12.2), RFID (8 pins), Wyswietlacz (C7.2 J4.1), STM-main (8 pins), Zasilanie (7 pins)
EN: ESP-WiFi (C13.2 Q1.3 R12.1 U2.2), STM-main (U1.32)
NetD2_1: ESP-WiFi (D2.1), STM-main (U1.30)
NetJ2_3: ESP-WiFi (J2.3 R13.1), STM-main (U1.31)
NetJ4_3: Wyswietlacz (J4.3), STM-main (U1.25)
NetJ4_4: Wyswietlacz (J4.4), STM-main (U1.26)
NetJ4_5: Wyswietlacz (J4.5), STM-main (U1.27)
NetJ4_6: Wyswietlacz (J4.6), STM-main (U1.28)
NetJ4_7: Wyswietlacz (J4.7), STM-main (U1.21)
NetJ4_8: Wyswietlacz (J4.8), STM-main (U1.46)
NetR6_1: STM-main (U1.11), Zasilanie (R6.1 R7.2)
NetR7_1: STM-main (U1.41), Zasilanie (R7.1)
NetR21_1: RFID (R21.1 U3.38), STM-main (U1.20)
NetR23_2: RFID (R23.2), STM-main (U1.16)
NetR24_2: RFID (R24.2), STM-main (U1.17)
NetR34_1: Buzzer (R34.1), STM-main (U1.29)
NetS2_1: Buttons (S2.1), STM-main (U1.33)
NetS3_1: Buttons (S3.1), STM-main (U1.10)
NetS4_1: Buttons (S4.1), STM-main (U1.18)
NetS5_1: Buttons (S5.1), STM-main (U1.19)
NetU1_12: RFID (U3.26), STM-main (U1.12)
NetU1_13: RFID (U3.25), STM-main (U1.13)
NetU1_14: RFID (U3.27), STM-main (U1.14)
NetU1_15: RFID (U3.30), STM-main (U1.15)
NRST: Buttons (S1.1), STM-main (J1.5 R32.1 U1.7)